# Altium schematic sheet RS485_Node.SchDoc
size A4
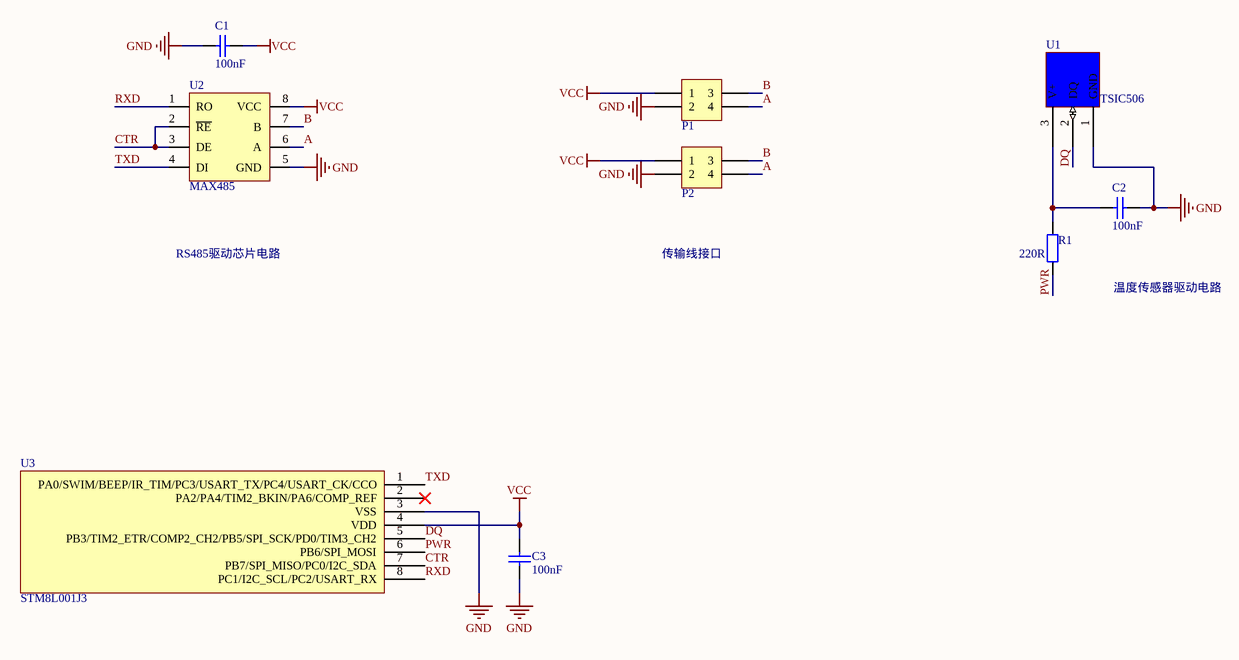
[diagram p0: RS485_Node.SchDoc]

## Parts
C1  value 100nF  [C_0603]  (hidden comment: Cap)
C2  value 100nF  [C_0603]  (hidden comment: Cap)
C3  value 100nF  [C_0603]  (hidden comment: Cap)
P1  Header 2X2B  [CONN_4PIN]  (value not drawn)
P2  Header 2X2B  [CONN_4PIN]  (value not drawn)
R1  value 220R  [R_0603]  (hidden comment: Res1)
U1  TSIC506  [TO92UA_A]
U2  MAX485  [SOIC_8]
U3  STM8L001J3  [SOIC_8]

## Nets
GND: C1.1 C2.2 C3.2 P1.2 P2.2 U1.1(GND) U2.5(GND) U3.3(VSS)
VCC: C1.2 C3.1 P1.1 P2.1 U2.8(VCC) U3.4(VDD)
A: P1.4 P2.4 U2.6(A)
B: P1.3 P2.3 U2.7(B)
CTR: U2.2(~{RE}) U2.3(DE) U3.7(PB7/SPI_MISO/PC0/I2C_SDA)
DQ: U1.2(DQ) U3.5(PB3/TIM2_ETR/COMP2_CH2/PB5/SPI_SCK/PD0/TIM3_CH2)
PWR: R1.1 U3.6(PB6/SPI_MOSI)
RXD: U2.1(RO) U3.8(PC1/I2C_SCL/PC2/USART_RX)
TXD: U2.4(DI) U3.1(PA0/SWIM/BEEP/IR_TIM/PC3/USART_TX/PC4/USART_CK/CCO)
NetC2_1: C2.1 R1.2 U1.3(V+)

Not connected (* = marked no-connect by the designer): U3 2(PA2/PA4/TIM2_BKIN/PA6/COMP_REF)*

## Notes on the sheet
- RS485驱动芯片电路
- 传输线接口
- 温度传感器驱动电路

## Library data of the parts
C1-C3 = Cap: 无极性电容; Published: 8-Jun-2000; LatestRevisionDate: 17-Jul-2002; LatestRevisionNote: Re-released for DXP Platform.; PackageReference: RAD-0.3; Publisher: Altium Limited
P1 P2 = Header 2X2B: 接插件; LatestRevisionDate: 17-Jul-2002; LatestRevisionNote: Re-released for DXP Platform.; Publisher: Altium Limited
R1 = Res1: 贴片电阻; Published: 8-Jun-2000; LatestRevisionDate: 17-Jul-2002; LatestRevisionNote: Re-released for DXP Platform.; PackageReference: AXIAL-0.4; Publisher: Altium Limited
U1 = TSIC506: TSic TM系列芯片采用基于世界领先水平的专业校准技术对温度传感器进行预先校准，测量使用简单，可长期稳定地达到高精度效果。
U3 = STM8L001J3: The STM8S001J3 device provides the following benefits: performance, robustness and reduced system cost. / Device performance and robustness are ensured by true data EEPROM supporting up to 100000 write/erase cycles, advanced core and peripherals made in a state-of-the-art technology at 16 MHz clock frequency, robust I/Os, independent watchdogs with separate clock source, and a clock security system. / The system cost is reduced thanks to a high system integration level with internal clock oscillators, watchdog, and brown-out reset. / Full documentation is offered as well as a wide choice of development tools.